# EAGLE design Keyboard_C64_connector_PCB (EAGLE 9.6.0)
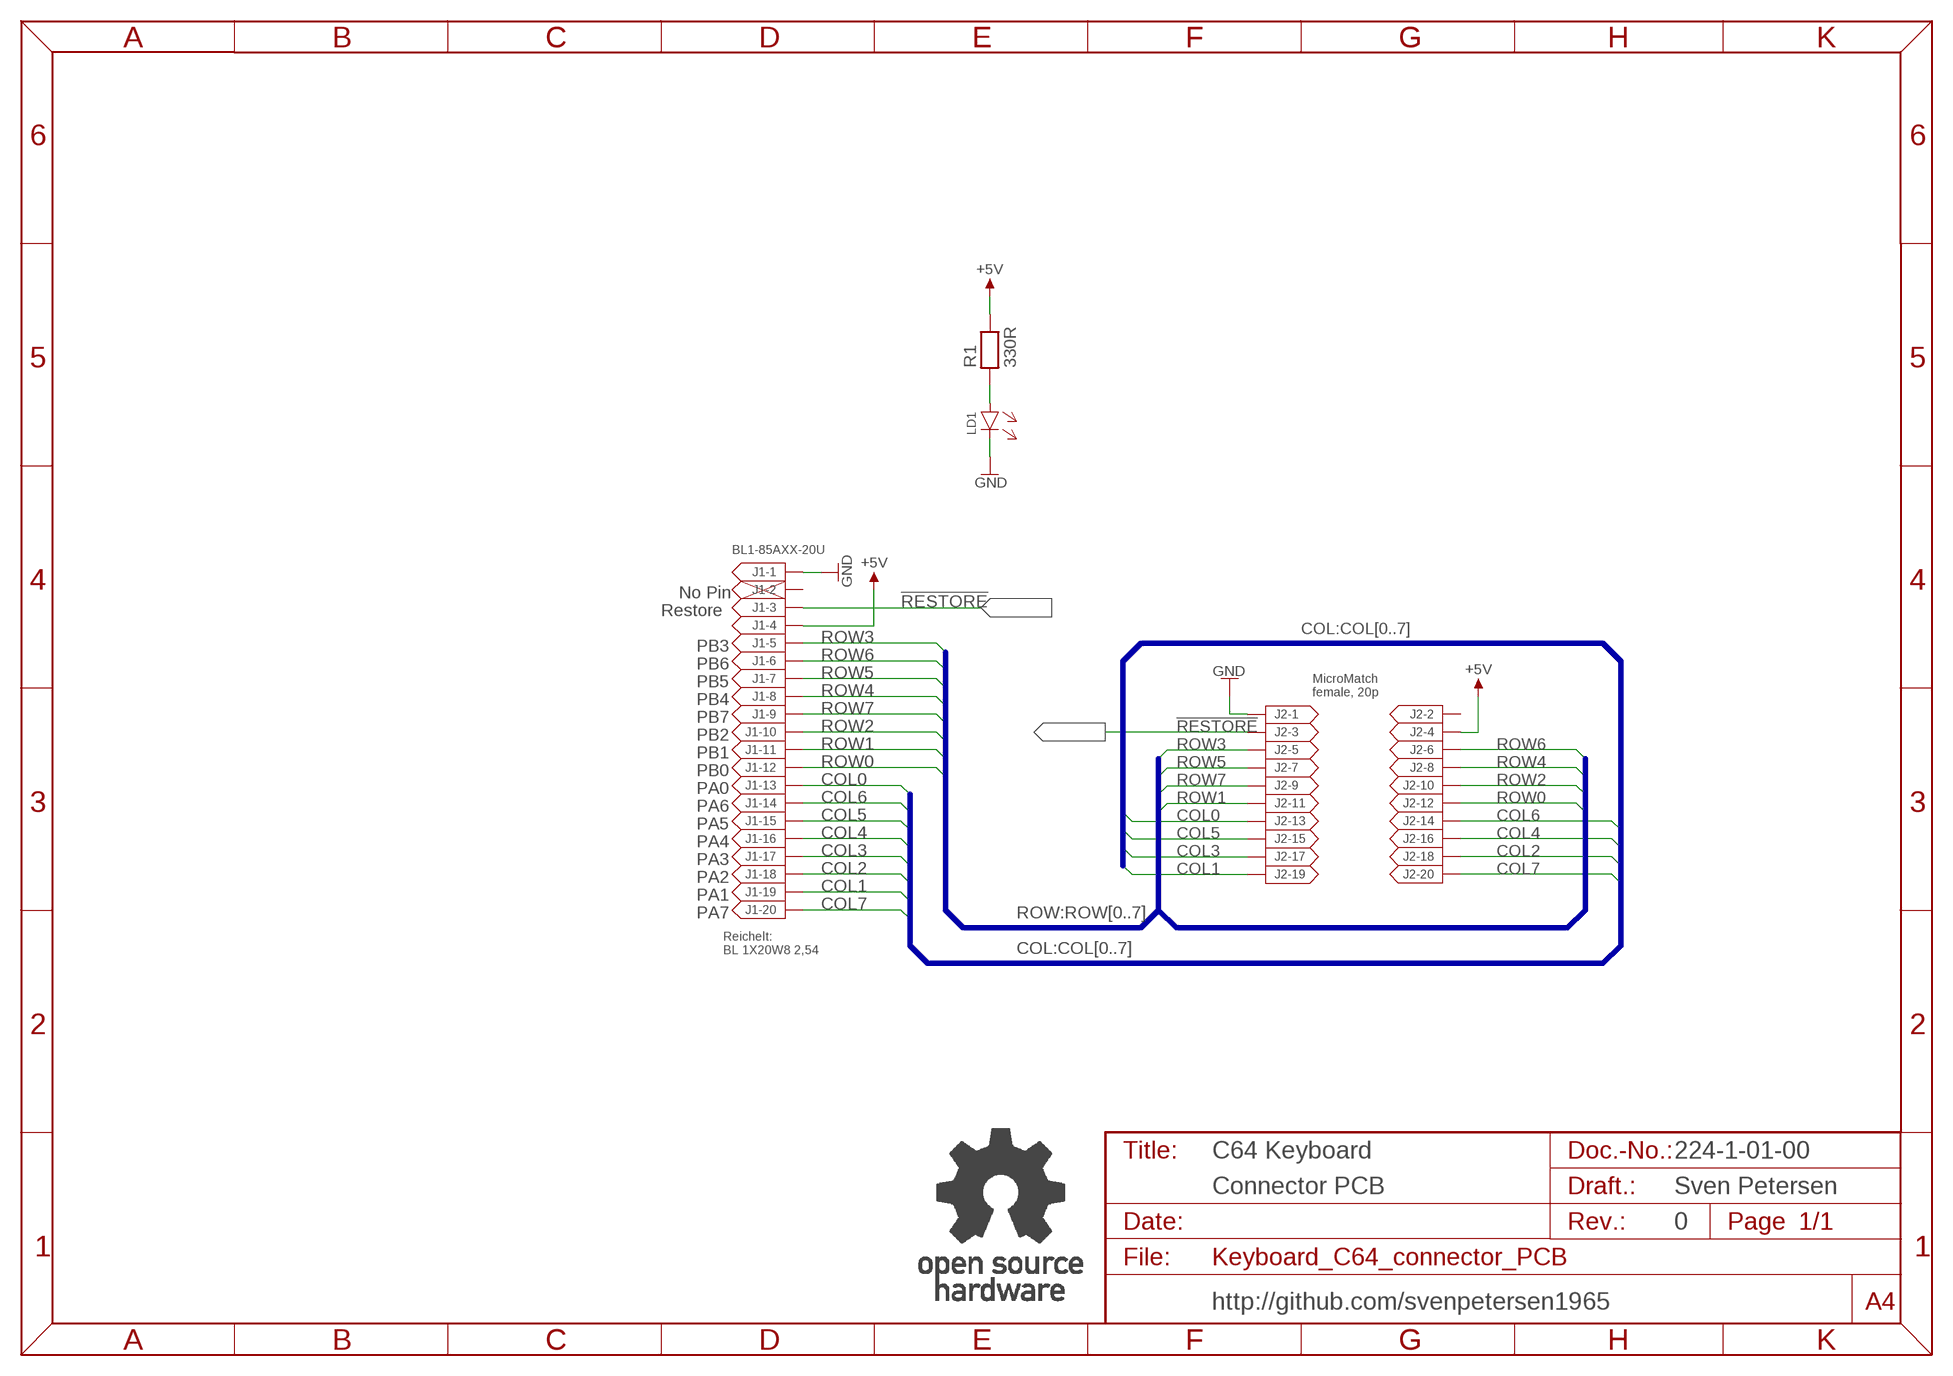
[diagram p0: schematic, sheet 1]

## Parts
J1  BL1-85AXX-20U  [BL1-85AXX-20U]
J2  MICMA20B  [MICMA20B]
LD1  3MM  [3MM]
R1  330R  RES04  [R-10]
U$9  OPEN_SOURCE_HW  [OPENHW]

## Nets
!RESTORE: J1.3 J2.3
+5V: J1.4 J2.4 R1.2
COL0: J1.13 J2.13
COL1: J1.19 J2.19
COL2: J1.18 J2.18
COL3: J1.17 J2.17
COL4: J1.16 J2.16
COL5: J1.15 J2.15
COL6: J1.14 J2.14
COL7: J1.20 J2.20
GND: J1.1 J2.1 LD1.C(K)
N$1: LD1.A R1.1
ROW0: J1.12 J2.12
ROW1: J1.11 J2.11
ROW2: J1.10 J2.10
ROW3: J1.5 J2.5
ROW4: J1.8 J2.8
ROW5: J1.7 J2.7
ROW6: J1.6 J2.6
ROW7: J1.9 J2.9
Unconnected: J1.2 J2.2

## Buses
COL:COL[0..7]
ROW:ROW[0..7]

## Notes on the sheet
- No Pin
- Restore
- PB3
- PB6
- PB5
- MicroMatch
  female, 20p
- PB4
- PB7
- PB2
- PB1
- PB0
- PA0
- PA6
- PA5
- PA4
- PA3
- PA2
- PA1
- PA7
- Reichelt:
  BL 1X20W8 2,54
- C64 Keyboard | 224-1-01-00
- Connector PCB | Sven Petersen
- 0
- http://github.com/svenpetersen1965

## Library data of the parts
J1 = MPE_Garry:BL1-85AXX-20U
J2 = AMP:MICMA20B
LD1 = LED:3MM
R1 = DISCRETE:RES04
U$9 = Logo:OPEN_SOURCE_HW

## Board
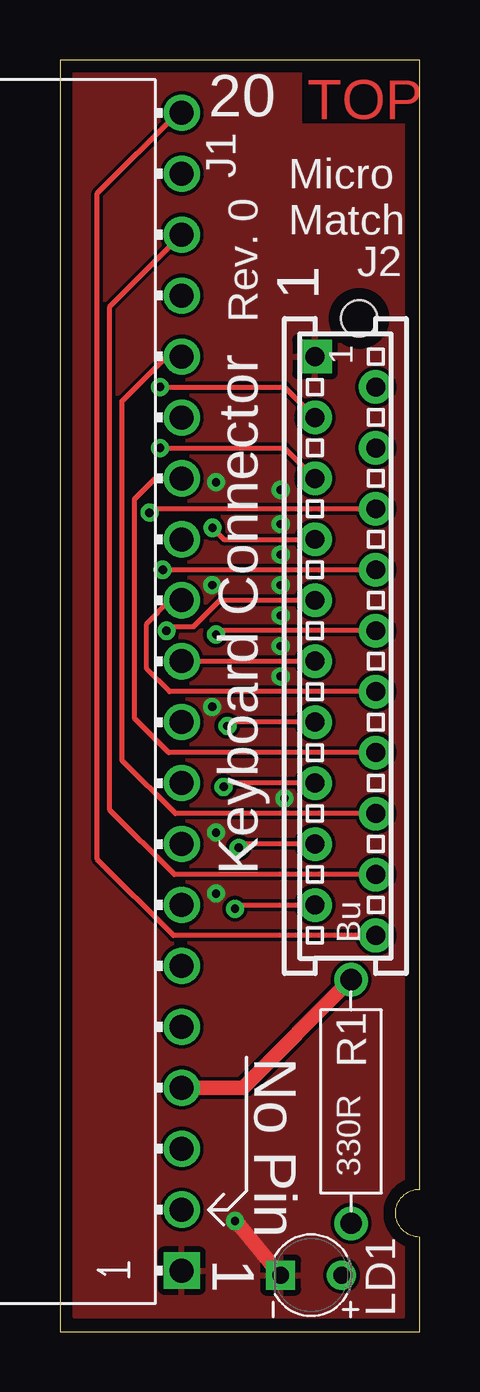
[diagram p1: board, top side]
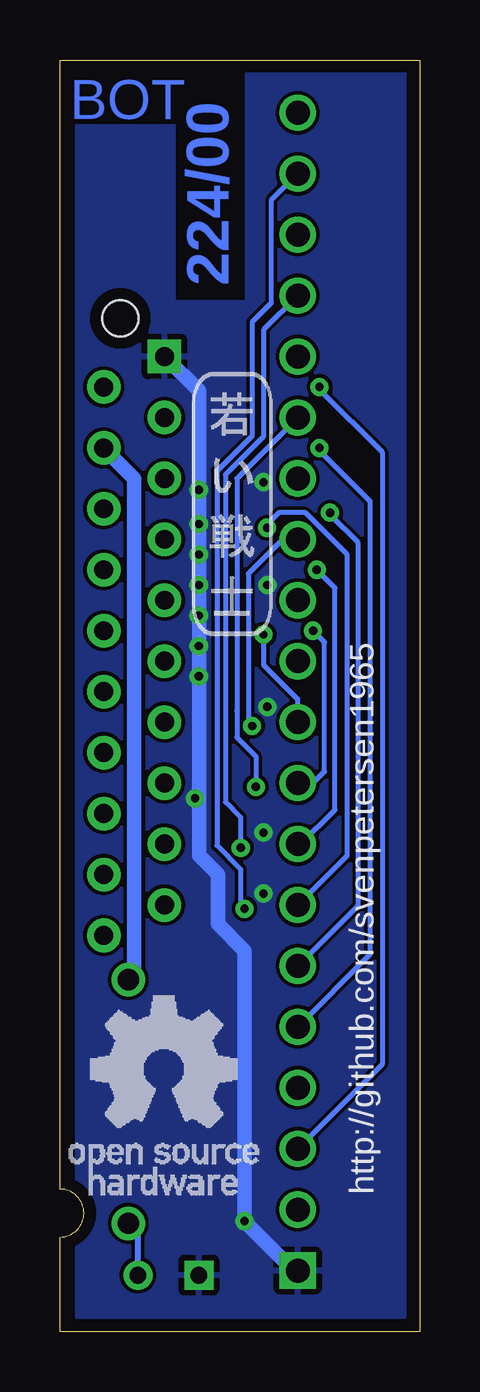
[diagram p2: board, bottom side, seen from below]

Size 15 x 53 mm. Coordinates in mm from the lower left corner, seen from the top.
Outline: 0,0 15,0 15,3.94 arc-180 15,5.94 15,53 0,53 0,0
Copper layers (1*16): Top 0.035mm / dielectric 1.5mm / Bottom 0.035mm
Design rules "default *": minimum track width 6mil, minimum drill 0.35mm, track to track 6mil, track to pad 6mil, pad to pad 6mil, via to via 6mil, smd to smd 6mil, copper to edge 20mil, drill to drill 8mil, minimum pad ring 10mil, minimum via ring 8mil, stop-mask expansion 4mil, vias tented up to drill 24mil, thermal gap 10mil
bRestrict: 3 lines

### Footprints (pad centres in the part's own frame; a part is rotated, then mirrored left to right if it is on the bottom)
BL1-85AXX-20U = drill 1 square: 1 -24.13,0 | drill 1: 2 -21.59,0; 3 -19.05,0; 4 -16.51,0; 5 -13.97,0; 6 -11.43,0; 7 -8.89,0; 8 -6.35,0; 9 -3.81,0; 10 -1.27,0; 11 1.27,0; 12 3.81,0; 13 6.35,0; 14 8.89,0; 15 11.43,0; 16 13.97,0; 17 16.51,0; 18 19.05,0; 19 21.59,0; 20 24.13,0
MICMA20B = drill 0.787 pad 1.397 square: 1 12.065,1.27 | drill 0.787 pad 1.397: 2 10.795,-1.27; 3 9.525,1.27; 4 8.255,-1.27; 5 6.985,1.27; 6 5.715,-1.27; 7 4.445,1.27; 8 3.175,-1.27; 9 1.905,1.27; 10 0.635,-1.27; 11 -0.635,1.27; 12 -1.905,-1.27; 13 -3.175,1.27; 14 -4.445,-1.27; 15 -5.715,1.27; 16 -6.985,-1.27; 17 -8.255,1.27; 18 -9.525,-1.27; 19 -10.795,1.27; 20 -12.065,-1.27 | hole 1.5: 13.652,-0.568
3MM = drill 0.7: A -1.27,0 | drill 0.7 square: C 1.27,0
R-10 = drill 0.889 pad 1.397: 1 -5.08,0; 2 5.08,0

### Placement (x,y rotation side)
J1  5.08,26.67 90 top
J2  11.91,28.57 90 top
LD1  10.48,2.35 180 top
R1  12.14,9.59 90 top
U$6  [2LAYER]  10.3,50.53 0 top
U$7  [PCB-TITLE/]  0,60 0 top  (outside the outline)
U$8  [SVEN_TAG]  7.78,34.61 0 bottom
U$9  14.61,5.71 0 bottom

### Tracks (layer width: path | path; a pad name or v marks a point on that pad's centre or on a via)
!RESTORE  (via drill 0.35)
  Top 0.203: v4.18,39.37 9.37,39.37 J2.3
  Bottom 0.203: v4.18,39.37 4.18,39.26 1.56,36.65 1.56,11.14 J1.3
+5V
  Top 0.61: J1.4 7.63,10.16 R1.2
  Bottom 0.61: J2.4 11.91,35.56 11.91,14.67 R1.2
COL0  (via drill 0.35)
  Top 0.203: J2.13 7.14,25.4 v6.99,25.24
  Bottom 0.203: J1.13 5.71,33.02 7.14,31.59 7.14,25.4 v6.99,25.24
COL1  (via drill 0.35)
  Top 0.203: v7.3,17.62 7.46,17.78 J2.19
  Bottom 0.203: J1.19 6.19,47.15 6.19,42.86 6.99,42.07 6.99,37.33 8.45,35.87 8.45,20.26 7.46,19.27 7.46,17.62 v7.3,17.62
COL2
  Top 0.203: J2.18 4.78,19.05 2.08,21.75 2.08,42.72 J1.18
COL3  (via drill 0.35)
  Top 0.203: J2.17 7.62,20.32 v7.46,20.16
  Bottom 0.203: J1.17 6.51,41.75 6.51,37.31 8.1,35.72 8.1,22.07 7.46,21.43 v7.46,20.16
COL4
  Top 0.203: J1.16 4.45,40.64 2.59,38.79 2.59,23.81 4.81,21.59 J2.16
COL5  (via drill 0.35)
  Top 0.203: J2.15 6.99,22.86 v6.83,22.7
  Bottom 0.203: J1.15 7.62,35.56 7.62,25.88 7.62,24.77 6.83,23.97 v6.83,22.7
COL6
  Top 0.203: J1.14 3.97,35.56 3.1,34.7 3.1,25.56 4.53,24.13 J2.14
COL7
  Top 0.203: J1.20 4.92,50.8 1.56,47.44 1.56,19.68 4.74,16.51 J2.20
GND  (via drill 0.35)
  Top 0.61: LD1.C 7.46,4.45 v7.3,4.6
  Bottom 0.61: J1.1 5.24,2.54 v7.3,4.6 7.3,15.88 8.41,16.99 8.41,19.05 9.21,19.84 9.21,39.21 J2.1
  other vias: 6.51,18.26 6.51,20.8 9.37,22.23 6.35,26.04 9.21,27.3 9.21,28.57 9.21,29.84 9.21,31.11 9.21,32.38 9.21,33.66 9.21,35.08 6.51,35.4 6.35,31.11
  pour Top: 0.64,52.55 14.29,52.55 14.29,0.64 0.64,0.64
  pour Bottom: 0.64,52.55 14.29,52.55 14.29,0.64 0.64,0.64
N$1
  Bottom 0.254: LD1.A 11.75,4.11 R1.1
ROW0
  Top 0.203: J1.12 4.6,30.48 3.62,29.5 3.62,27.62 4.57,26.67 J2.12
ROW1
  Top 0.203: J1.11 J2.11
ROW2  (via drill 0.35)
  Top 0.203: J2.10 6.67,29.21 v6.51,29.05
  Bottom 0.203: J1.10 5.08,26.35 6.51,27.78 v6.51,29.05
ROW3  (via drill 0.35)
  Top 0.203: v4.18,36.83 9.37,36.83 J2.5
  Bottom 0.203: v4.18,36.83 4.18,36.72 2.06,34.61 2.06,15.72 J1.5
ROW4  (via drill 0.35)
  Top 0.203: J2.8 v4.29,31.75
  Bottom 0.203: J1.8 4.96,20.32 3.53,21.75 3.53,30.99 v4.29,31.75
ROW5  (via drill 0.35)
  Top 0.203: v6.37,33.5 6.84,33.02 J2.7
  Bottom 0.203: J1.7 3.02,19.84 3.02,32.38 4.76,34.13 5.87,34.13 6.37,33.64 v6.37,33.5
ROW6  (via drill 0.35)
  Top 0.203: J2.6 3.9,34.29 v3.74,34.13
  Bottom 0.203: v3.74,34.13 3.74,34.06 2.58,32.9 2.58,17.74 J1.6
ROW7  (via drill 0.35)
  Top 0.203: v4.45,29.21 4.6,29.37 5.56,29.37 6.67,30.48 J2.9
  Bottom 0.203: J1.9 4.45,22.86 3.97,23.34 3.97,28.73 v4.45,29.21

### Text on the board
Bottom: 224/00
tPlace: 20 | 1 | Rev. 0 | Keyboard Connector | No Pin | 1
bPlace: http://github.com/svenpetersen1965
tNames: Micro / Match | 330R
Document: 224-2-01-00 | Sven Petersen / 2025 | 35µm | 2 | 0